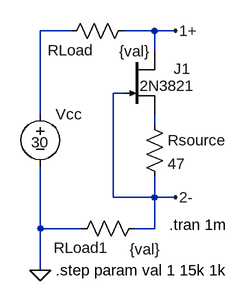
[diagram p0: schematic 1mA_FetConstCorr.asc]
1mA_FetConstCorr.asc, the LTspice schematic file:
Version 4
SHEET 1 880 680
WIRE -64 80 -112 80
WIRE 64 80 16 80
WIRE 96 80 64 80
WIRE 64 112 64 80
WIRE 16 176 0 176
WIRE -112 208 -112 80
WIRE 64 224 64 208
WIRE 0 336 0 176
WIRE 64 336 64 304
WIRE 64 336 0 336
WIRE 96 336 64 336
WIRE -112 384 -112 288
WIRE -48 384 -112 384
WIRE 64 384 64 336
WIRE 64 384 32 384
WIRE -112 448 -112 384
FLAG -112 448 0
FLAG 96 80 1+
FLAG 96 336 2-
SYMBOL voltage -112 192 R0
WINDOW 3 -14 59 Left 0
SYMATTR Value 30
SYMATTR InstName Vcc
SYMBOL njf 16 112 R0
WINDOW 0 77 26 Left 0
WINDOW 3 25 52 Left 0
SYMATTR InstName J1
SYMATTR Value 2N3821
SYMBOL res 48 208 R0
SYMATTR InstName Rsource
SYMATTR Value 47
SYMBOL res 32 64 R90
WINDOW 0 61 97 VBottom 0
WINDOW 3 32 -1 VTop 0
SYMATTR InstName RLoad
SYMATTR Value {val}
SYMBOL res 48 368 R90
WINDOW 0 61 97 VBottom 0
WINDOW 3 32 -1 VTop 0
SYMATTR InstName RLoad1
SYMATTR Value {val}
TEXT -88 448 Left 0 !.step param val 1 15k 1k
TEXT 86 378 Left 0 !.tran 1m

The netlist it stands for:
* 1mA_FetConstCorr.asc
Vcc N001 0 30
J1 1+ 2- N002 2N3821
Rsource N002 2- 47
RLoad 1+ N001 {val}
RLoad1 2- 0 {val}
.model NJF NJF
.model PJF PJF
.lib standard.jft
.step param val 1 15k 1k
.tran 1m
.backanno
.end